# Altium schematic sheet BRAINS.SchDoc: Top Level
size A3; CompanyName: NOT USED; SheetNumber: 0; SheetTotal: 0; PageSetup: Record=PageOptions|CenterHorizontal=True|CenterVertical=True|PrintScale=1.00|XCorrection=1.00|YCorrection=1.00|PrintKind=0|BorderSize=5000000|LeftOffset=0|BottomOffset=0|Orientation=2|PaperLength=1000|PaperWidth=1000|Scale=100|PaperSource=7|PrintQuality=-4|MediaType=1|DitherType=10|PaperKind=A3|PrintScaleMode=0
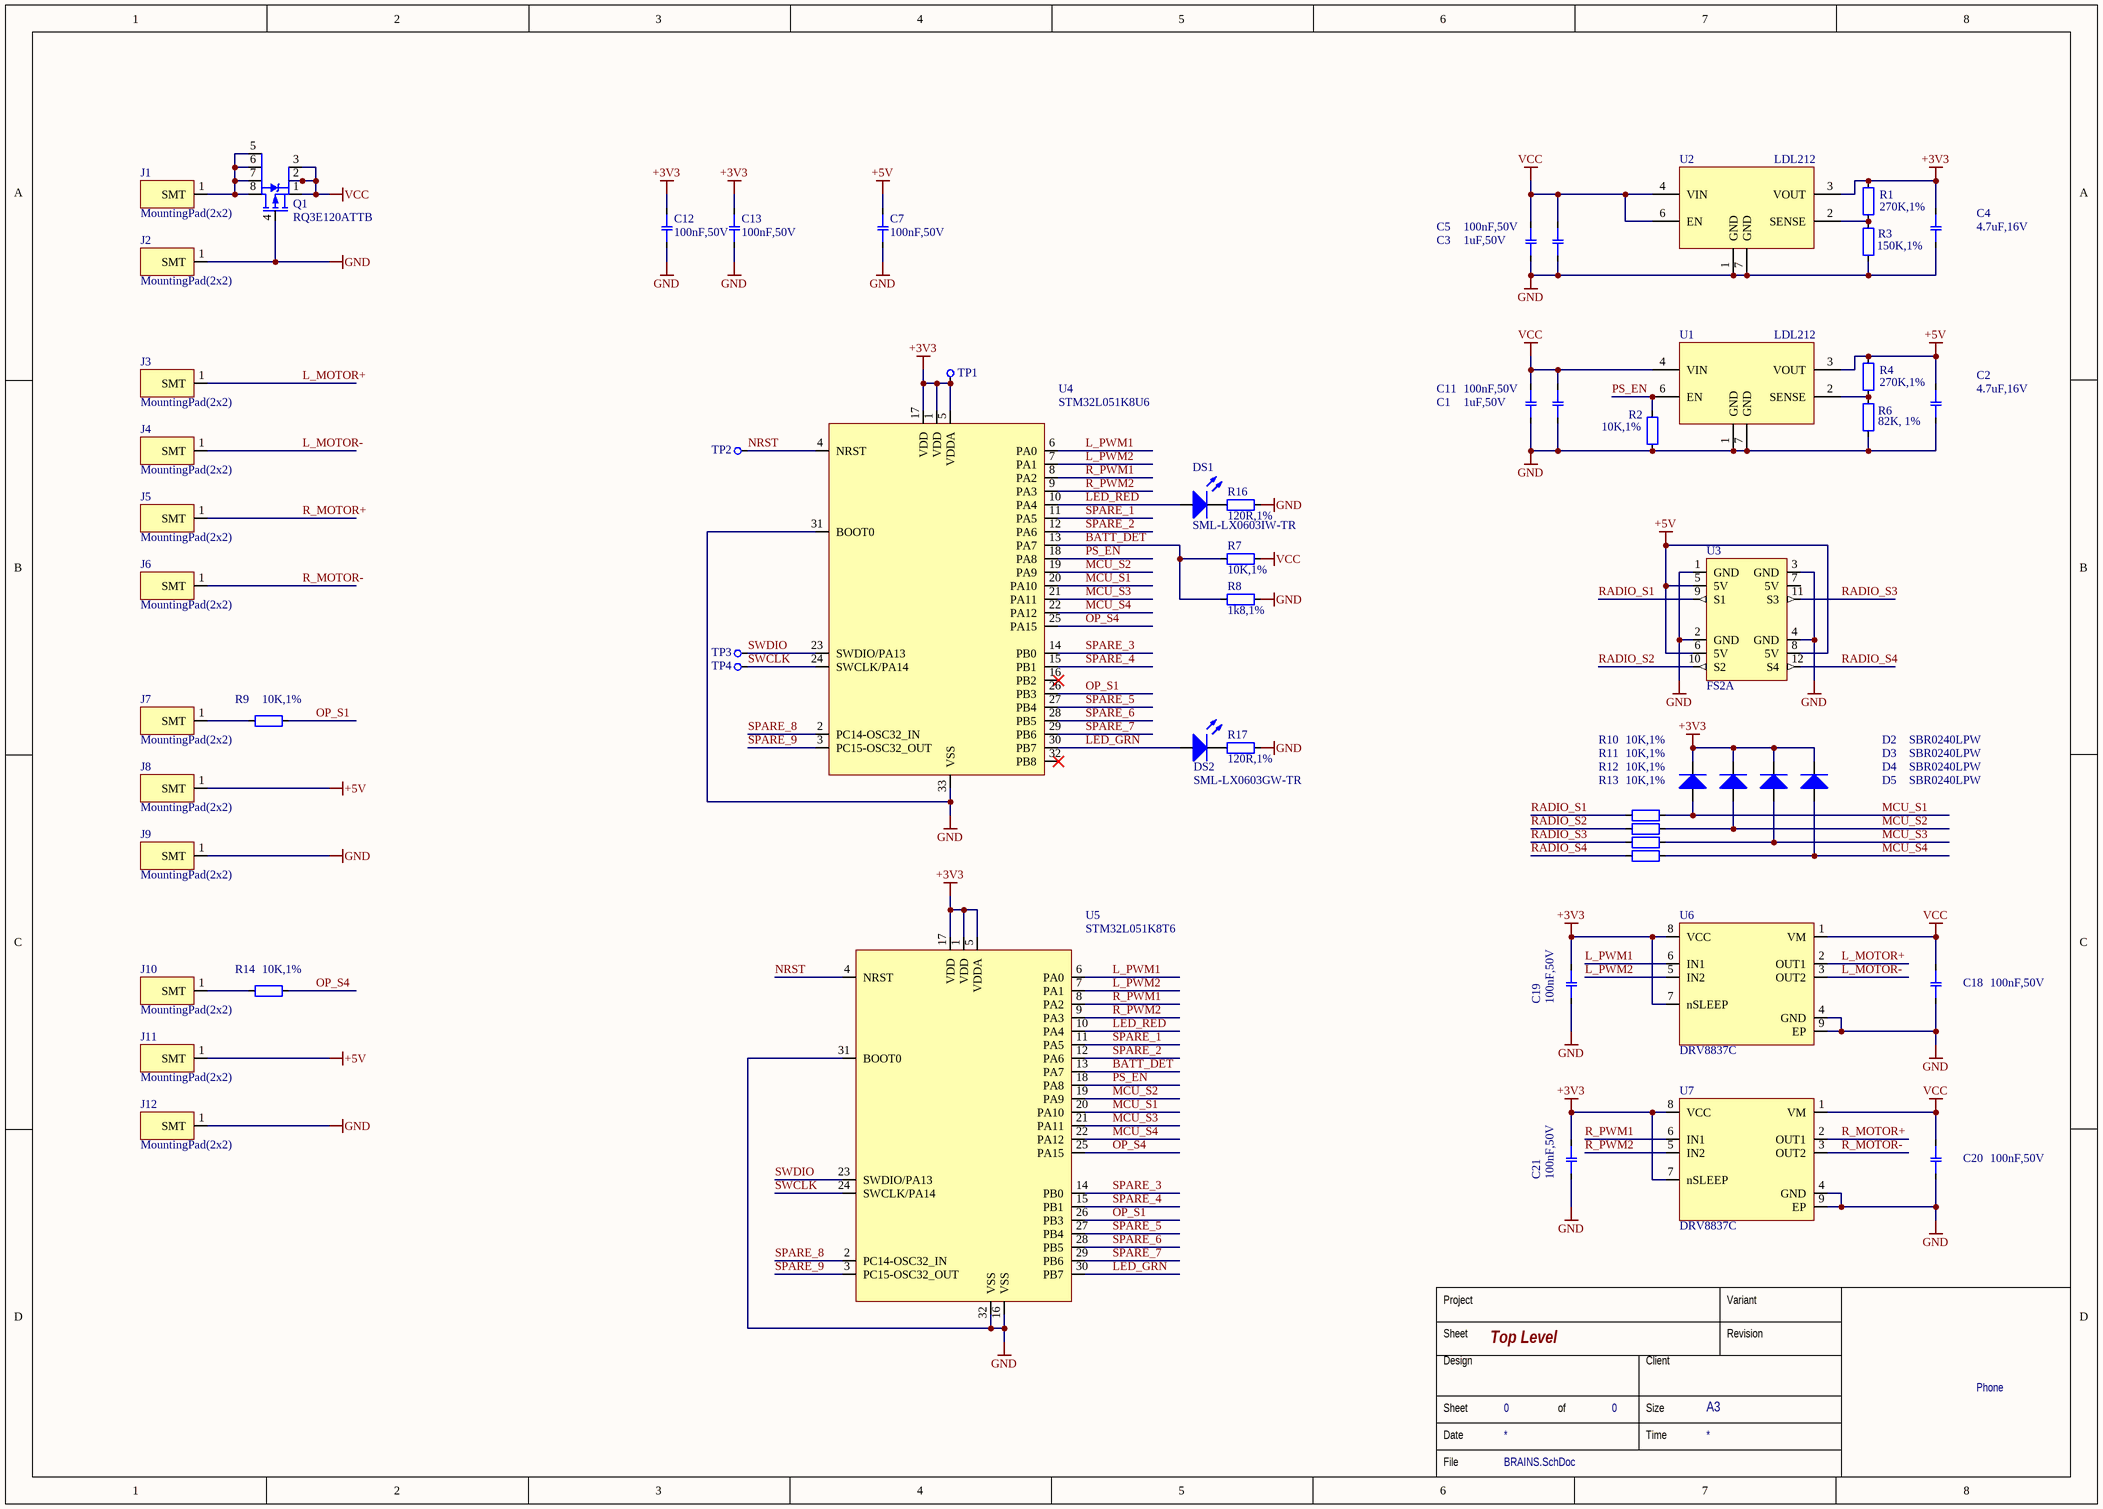
[diagram p0: BRAINS.SchDoc]

## Parts
C1  1uF,50V  [CAPC1005X05N_0402]
C2  4.7uF,16V  [CAPC1005X05N_0402]
C3  1uF,50V  [CAPC1005X05N_0402]
C4  4.7uF,16V  [CAPC1005X05N_0402]
C5  100nF,50V  [CAPC1005X05N_0402]
C7  100nF,50V  [CAPC1005X05N_0402]
C11  100nF,50V  [CAPC1005X05N_0402]
C12  100nF,50V  [CAPC1005X05N_0402]
C13  100nF,50V  [CAPC1005X05N_0402]
C18  100nF,50V  [CAPC1005X05N_0402]
C19  100nF,50V  [CAPC1005X05N_0402]
C20  100nF,50V  [CAPC1005X05N_0402]
C21  100nF,50V  [CAPC1005X05N_0402]
D2  SBR0240LPW  [TVS0402]
D3  SBR0240LPW  [TVS0402]
D4  SBR0240LPW  [TVS0402]
D5  SBR0240LPW  [TVS0402]
DS1  SML-LX0603IW-TR  [LED_SML-LX0603]
DS2  SML-LX0603GW-TR  [LED_SML-LX0603]
J1  MountingPad(2x2)  [MountingPad(2x2)]
J2  MountingPad(2x2)  [MountingPad(2x2)]
J3  MountingPad(2x2)  [MountingPad(2x2)]
J4  MountingPad(2x2)  [MountingPad(2x2)]
J5  MountingPad(2x2)  [MountingPad(2x2)]
J6  MountingPad(2x2)  [MountingPad(2x2)]
J7  MountingPad(2x2)  [MountingPad(2x2)]
J8  MountingPad(2x2)  [MountingPad(2x2)]
J9  MountingPad(2x2)  [MountingPad(2x2)]
J10  MountingPad(2x2)  [MountingPad(2x2)]
J11  MountingPad(2x2)  [MountingPad(2x2)]
J12  MountingPad(2x2)  [MountingPad(2x2)]
Q1  RQ3E120ATTB  [ROHM-HSMT8]
R1  270K,1%  [RESC1005X04N_0402]
R2  10K,1%  [RESC1005X04N_0402]
R3  150K,1%  [RESC1005X04N_0402]
R4  270K,1%  [RESC1005X04N_0402]
R6  82K, 1%  [RESC1005X04N_0402]
R7  10K,1%  [RESC1005X04N_0402]
R8  1k8,1%  [RESC1005X04N_0402]
R9  10K,1%  [RESC1005X04N_0402]
R10  10K,1%  [RESC1005X04N_0402]
R11  10K,1%  [RESC1005X04N_0402]
R12  10K,1%  [RESC1005X04N_0402]
R13  10K,1%  [RESC1005X04N_0402]
R14  10K,1%  [RESC1005X04N_0402]
R16  120R,1%  [RESC1005X04N_0402]
R17  120R,1%  [RESC1005X04N_0402]
TP1  TP_SMT  [TP_050]  (value not drawn)
TP2  TP_SMT  [TP_050]  (value not drawn)
TP3  TP_SMT  [TP_050]  (value not drawn)
TP4  TP_SMT  [TP_050]  (value not drawn)
U1  LDL212  [DFN65P300X300X80-8N_PWSON6]
U2  LDL212  [DFN65P300X300X80-8N_PWSON6]
U3  FS2A  [FS2A]
U4  STM32L051K8U6  [QFN50P500X500X100-32N_32QFN_2]
U5  STM32L051K8T6  [LQFP32]
U6  DRV8837C  [DFN50P200X200X80-8N]
U7  DRV8837C  [DFN50P200X200X80-8N]

## Nets
+3V3: C4.2 C12.2 C13.2 C19.2 C21.2 D2.1(C) D3.1(C) D4.1(C) D5.1(C) R1.2 TP1.1 U2.3(VOUT) U4.1(VDD) U4.5(VDDA) U4.17(VDD) U5.1(VDD) U5.5(VDDA) U5.17(VDD) U6.7(nSLEEP) U6.8(VCC) U7.7(nSLEEP) U7.8(VCC)
+5V: C2.2 C7.2 J8.1(SMT) J11.1(SMT) R4.2 U1.3(VOUT) U3.5(5V) U3.6(5V) U3.8(5V)
GND: C1.1 C2.1 C3.1 C4.1 C5.1 C7.1 C11.1 C12.1 C13.1 C18.1 C19.1 C20.1 C21.1 J2.1(SMT) J9.1(SMT) J12.1(SMT) Q1.4(G) R2.1 R3.1 R6.1 R8.1 R16.1 R17.1 U1.1(GND) U1.7(GND) U2.1(GND) U2.7(GND) U3.1(GND) U3.2(GND) U3.3(GND) U3.4(GND) U4.31(BOOT0) U4.33(VSS) U5.16(VSS) U5.31(BOOT0) U5.32(VSS) U6.4(GND) U6.9(EP) U7.4(GND) U7.9(EP)
VCC: C1.2 C3.2 C5.2 C11.2 C18.2 C20.2 Q1.1(S) Q1.2(S) Q1.3(S) R7.1 U1.4(VIN) U2.4(VIN) U2.6(EN) U6.1(VM) U7.1(VM)
BATT_DET: R7.2 R8.2 U4.13(PA7) U5.13(PA7)
L_MOTOR+: J3.1(SMT) U6.2(OUT1)
L_MOTOR-: J4.1(SMT) U6.3(OUT2)
L_PWM1: U4.6(PA0) U5.6(PA0) U6.6(IN1)
L_PWM2: U4.7(PA1) U5.7(PA1) U6.5(IN2)
LED_GRN: DS2.2(A) U4.30(PB7) U5.30(PB7)
LED_RED: DS1.2(A) U4.10(PA4) U5.10(PA4)
MCU_S1: D5.2(A) R10.1 U4.20(PA10) U5.20(PA10)
MCU_S2: D4.2(A) R11.1 U4.19(PA9) U5.19(PA9)
MCU_S3: D3.2(A) R12.1 U4.21(PA11) U5.21(PA11)
MCU_S4: D2.2(A) R13.1 U4.22(PA12) U5.22(PA12)
NRST: TP2.1 U4.4(NRST) U5.4(NRST)
OP_S1: R9.1 U4.26(PB3) U5.26(PB3)
OP_S4: R14.1 U4.25(PA15) U5.25(PA15)
PS_EN: R2.2 U1.6(EN) U4.18(PA8) U5.18(PA8)
R_MOTOR+: J5.1(SMT) U7.2(OUT1)
R_MOTOR-: J6.1(SMT) U7.3(OUT2)
R_PWM1: U4.8(PA2) U5.8(PA2) U7.6(IN1)
R_PWM2: U4.9(PA3) U5.9(PA3) U7.5(IN2)
RADIO_S1: R10.2 U3.9(S1)
RADIO_S2: R11.2 U3.10(S2)
RADIO_S3: R12.2 U3.11(S3)
RADIO_S4: R13.2 U3.12(S4)
SPARE_1: U4.11(PA5) U5.11(PA5)
SPARE_2: U4.12(PA6) U5.12(PA6)
SPARE_3: U4.14(PB0) U5.14(PB0)
SPARE_4: U4.15(PB1) U5.15(PB1)
SPARE_5: U4.27(PB4) U5.27(PB4)
SPARE_6: U4.28(PB5) U5.28(PB5)
SPARE_7: U4.29(PB6) U5.29(PB6)
SPARE_8: U4.2(PC14-OSC32_IN) U5.2(PC14-OSC32_IN)
SPARE_9: U4.3(PC15-OSC32_OUT) U5.3(PC15-OSC32_OUT)
SWCLK: TP4.1 U4.24(SWCLK/PA14) U5.24(SWCLK/PA14)
SWDIO: TP3.1 U4.23(SWDIO/PA13) U5.23(SWDIO/PA13)
NetDS1_1: DS1.1(C) R16.2
NetDS2_1: DS2.1(C) R17.2
NetJ1_1: J1.1(SMT) Q1.5(D) Q1.6(D) Q1.7(D) Q1.8(D)
NetJ7_1: J7.1(SMT) R9.2
NetJ10_1: J10.1(SMT) R14.2
NetR1_1: R1.1 R3.2 U2.2(SENSE)
NetR4_1: R4.1 R6.2 U1.2(SENSE)

Not connected (* = marked no-connect by the designer): U3 7(5V); U4 16(PB2)* 32(PB8)*

## Notes on the sheet
- Project
- Variant
- Sheet
- Design
- Client
- Revision
- Phone
- Date
- of
- Size
- Time
- A3
- File

## Library data of the parts
C1 C3 = CCG-106DH-H: CAP CER 1UF 50V X5R 0402; Manufacturer: Taiyo Yuden; Manufacturer Part Number: UMK105CBJ105MV-F; Tolerance: 20%; Type: Ceramic; Display_Name: 1uF,50V; Capacitance: 1uF; Dielectric: X5R; Voltage: 50V; BWA PN: CCG-106DH-H; Schematic Symbol: CAP-NP_1; Supplier 1: Digi-Key; Supplier Part Number 1: 587-6278-1-ND
C2 C4 = CCG-476DE-H: CAP CER 4.7UF 16V X5R 0402; Manufacturer: AVX Corporation; Manufacturer Part Number: 0402YD475MAT2A; Tolerance: 20%; Type: Ceramic; Display_Name: 4.7uF,16V; Capacitance: 4.7uF; Dielectric: X5R; Voltage: 16V; BWA PN: CCG-476DE-H; Schematic Symbol: CAP-NP_1; Supplier 1: Digi-Key; Supplier Part Number 1: 478-10788-1-ND
C5 C7 C11-C13 C18-C21 = CCG-104CE-G: CAP CER 100nF 50V X7R 0402; Manufacturer: Taiyo Yuden; Manufacturer Part Number: UMK105B7104KV-FR; Tolerance: 10%; Type: Ceramic; Display_Name: 100nF,50V; Capacitance: 100nF; Dielectric: X7R; Voltage: 50V; BWA PN: CCG-104CE-G; Schematic Symbol: CAP-NP_1; Supplier 1: Digi-Key; Supplier Part Number 1: 587-3498-1-ND
D2-D5 = DIO-10207-A: SBR DIODE X1-DFN1006-2/SWP; Manufacturer: Diodes Incorporated; Manufacturer Part Number: SBR0240LPW-7B; Type: Standard; Vf@I: 290mV @10mA; Vr(max): 40V; d_if(max): 200mA; Display_Name: SBR0240LPW; BWA PN: DIO-10207-A; Schematic Symbol: DIODE_1; Supplier 1: Digi-Key; Supplier Part Number 1: SBR0240LPW-7BDICT-ND
DS1 = LED-10056-A: LED 635NM RED DIFF 0603 SMD; Manufacturer: Lumex Opto/Components Inc; Axial Intensity: 14mcd; If(max): 20mA; Lens type: Diffused, White; Lens Style/Size: Rectangle, 1mmx0.8mm; Vf@I: 2V; Viewing Angle: 160deg; Vr(max): 5V; Display_Name: SML-LX0603IW-TR; Wavelength: 635nm; BWA PN: LED-10056-A; Colour: Red; Schematic Symbol: LED_1; Manufacturer Part Number: SML-LX0603IW-TR; Supplier 1: Digi-Key; Supplier Part Number 1: 67-1548-1-ND
DS2 = LED-10011-A: LED 565NM GRN DIFF 0603 SMD; Manufacturer: Lumex Opto/Components Inc; Axial Intensity: 18mcd; Colour: Green; If(max): 25mA; Lens type: Diffused, White; Lens Style/Size: Rectangle, 1mmx0.8mm; Vf@I: 2.2V; Viewing Angle: 160deg; Vr(max): 5V; Display_Name: SML-LX0603GW-TR; Wavelength: 565nm; BWA PN: LED-10011-A; Schematic Symbol: LED_1; Manufacturer Part Number: SML-LX0603GW-TR; Supplier 1: Digi-Key; Supplier Part Number 1: 67-1549-1-ND
Q1 = TRN-10125-A: MOSFET P-CH 30V 12A 8HSMT; Manufacturer: Rohm Semiconductor; Type: P; Id(max): 12A (Ta); rds(on): 8mOhm @ 12A, 10V; Vgs(max): ±20V / ±20V / ±20V; Vth(max): 2.5V @ 1mA; Display_Name: RQ3E120ATTB; BWA PN: TRN-10125-A; Vds(max): 30V; Schematic Symbol: MOSFET-P_5; Manufacturer Part Number: RQ3E120ATTB; Supplier 1: Digi-Key; Supplier Part Number 1: RQ3E120ATTBCT-ND
R1 R4 = RSG-270K0-D: RES SMD 270K OHM 1% 1/16W 0402; Manufacturer: Yageo; Manufacturer Part Number: RC0402FR-07270KL; Power: 0.063W; Display_Name: 270K,1%; Resistance: 270K; Tolerance: 1%; Type: Chip; BWA PN: RSG-270K0-D; Schematic Symbol: RESISTOR_1; Supplier 1: Digi-Key; Supplier Part Number 1: 311-270KLRCT-ND
R2 R7 R9-R14 = RSG-10K00-D: RES 10K OHM 1/16W 1% 0402 SMD; Manufacturer: Yageo; Manufacturer Part Number: RC0402FR-0710KL; Power: 0.0625W; Display_Name: 10K,1%; Resistance: 10K; Tolerance: 1%; Type: Chip; BWA PN: RSG-10K00-D; Schematic Symbol: RESISTOR_1; Supplier 1: Digi-Key; Supplier Part Number 1: 311-10.0KLRCT-ND
R3 = RSG-150K0-D: RES SMD 150K OHM 1% 1/16W 0402; Manufacturer: Yageo; Manufacturer Part Number: RC0402FR-07150KL; Power: 0.063W; Display_Name: 150K,1%; Resistance: 150K; Tolerance: 1%; Type: Chip; BWA PN: RSG-150K0-D; Schematic Symbol: RESISTOR_1; Supplier 1: Digi-Key; Supplier Part Number 1: 311-150KLRCT-ND
R6 = RSG-82K00-D: RES SMD 82K OHM 1% 1/16W 0402; Manufacturer: YAGEO; Manufacturer Part Number: RC0402FR-0782KL; Power: 0.063W; Display_Name: 82K, 1%; Resistance: 82K; Tolerance: 1%; Type: Chip; BWA PN: RSG-82K00-D; Schematic Symbol: RESISTOR_1; Supplier 1: Digi-Key; Supplier Part Number 1: 311-82.0KLRCT-ND
R8 = RSG-1K800-D: RES 1k8 0.0625W 1% 0402 SMD; Manufacturer: Vishay Dale; Manufacturer Part Number: CRCW04021K80FKED; Display_Name: 1k8,1%; Power: 0.0625W; Resistance: 1k8; Tolerance: 1%; Type: Chip; BWA PN: RSG-1K800-D; Schematic Symbol: RESISTOR_1; Supplier 1: Digi-Key; Supplier Part Number 1: 541-1.80KLCT-ND
R16 R17 = RSG-120R0-D: RES 120 OHM 1/16W 0402 SMD; Manufacturer: Yageo; Manufacturer Part Number: RC0402FR-07120RL; Power: 0.0625W; Display_Name: 120R,1%; Resistance: 120R; Tolerance: 1%; Type: Chip; BWA PN: RSG-120R0-D; Schematic Symbol: RESISTOR_1; Supplier 1: Digi-Key; Supplier Part Number 1: 311-120LRCT-ND
TP1-TP4 = NONPART-002: Test Point - SMT; Display_Name: TP_SMT; BWA PN: NONPART-002; Schematic Symbol: TP_1
U1 U2 = ICT-10910-A: IC REG LINEAR 5V 1.2A 6DFN; Manufacturer: STMicroelectronics; Temp Range: -40°C ~ 125°C (TJ); Display_Name: LDL212; BWA PN: ICT-10910-A; Schematic Symbol: LDL212PU50R; Manufacturer Part Number: LDL212PU50R; Supplier 1: Digi-Key; Supplier Part Number 1: 497-16897-1-ND
U4 = ICT-10734-A: IC MCU 32BIT 64KB FLASH 32UFQFPN; Manufacturer: STMicroelectronics; Temp Range: -40°C ~ 85°C; Display_Name: STM32L051K8U6; BWA PN: ICT-10734-A; Schematic Symbol: STM32L051x6/8U; Manufacturer Part Number: STM32L051K8U6; Supplier 1: Digi-Key; Supplier Part Number 1: 497-17490-ND; Supplier 2: Mouser; Supplier Part Number 2: 511-STM32L051K8U6
U5 = ICT-10696-A: 32 Bit Mcirocontroler; Manufacturer: ST Microelectronics; Temp Range: -40°C ~ 85°C; Display_Name: STM32L051K8T6; BWA PN: ICT-10696-A; Schematic Symbol: STM32L051x6/8; Manufacturer Part Number: STM32L051K8T6; Supplier 1: Digi-Key; Supplier Part Number 1: 497-14901-ND
U6 U7 = ICT-10892-A: IC HALF-BRIDGE DRVR PWM 8WSON; Manufacturer: Texas Instruments; Manufacturer Part Number: DRV8837CDSGR; Temp Range: -40°C ~ 85°C; Display_Name: DRV8837C; BWA PN: ICT-10892-A; Schematic Symbol: DRV8837C; Supplier 1: Digi-Key; Supplier Part Number 1: 296-47205-1-ND